# Altium schematic sheet Schematic_Small_Unit_Altium.schdoc
size 280 x 164 mm
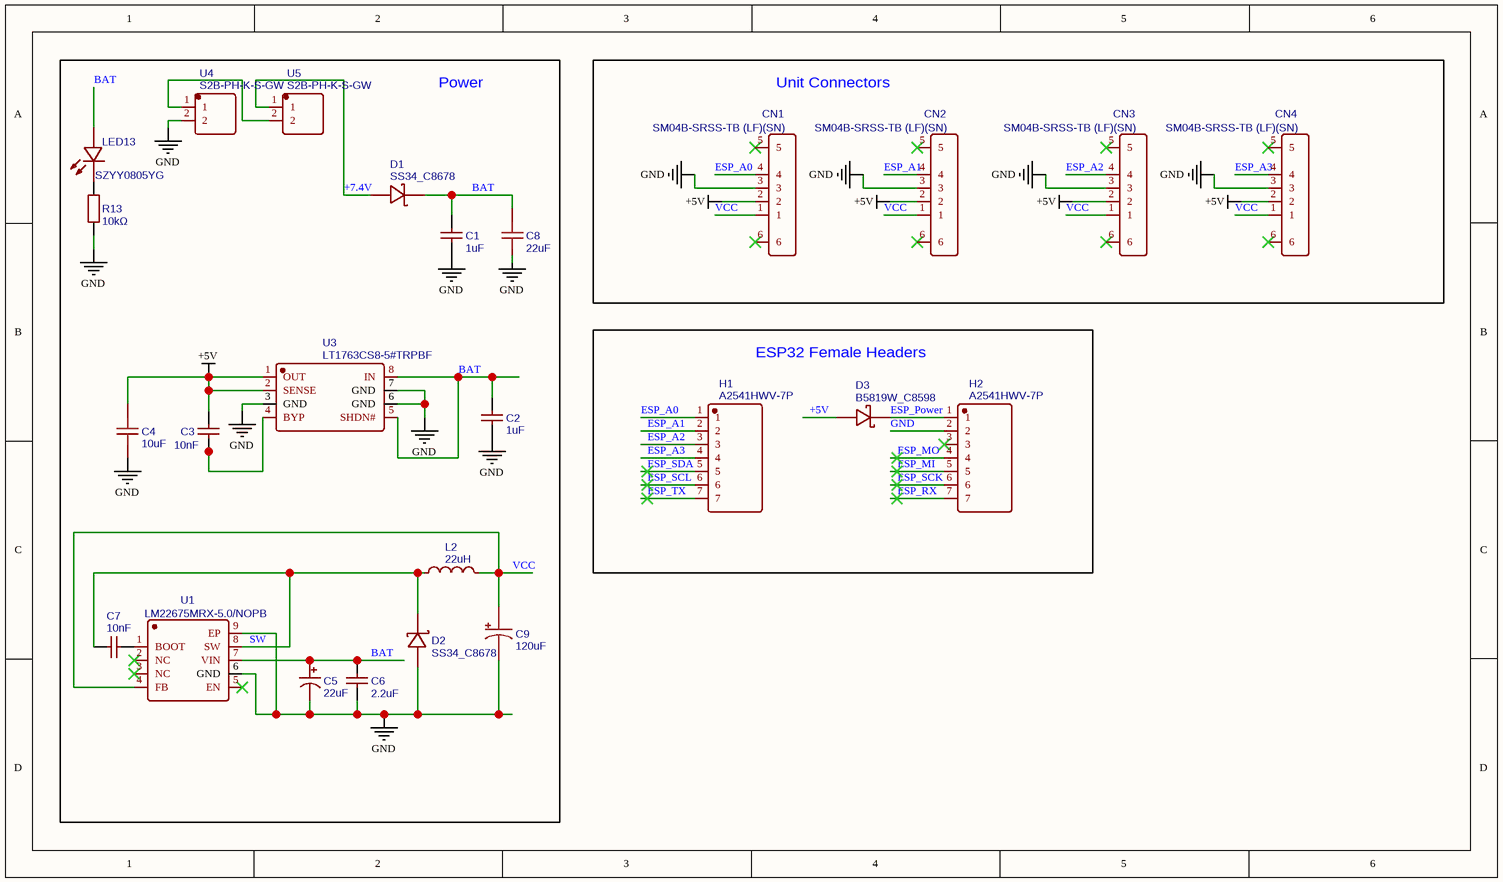
[diagram p0: Schematic_Small_Unit_Altium.schdoc]

## Parts
C1  1uF  [C0805]
C2  1uF  [C0805]
C3  10nF  [C0402]
C4  10uF  [C0603]
C5  22uF  [CAP-SMD_BD5.0-L5.3-W5.3-FD]
C6  2.2uF  [C0603]
C7  10nF  [C0402]
C8  22uF  [C0805]
C9  120uF  [CAP-SMD_BD6.3-L6.6-W6.6-FD]
CN1  SM04B-SRSS-TB (LF)(SN)  [CONN-SMD_4P-P1.00_SM04B-SRSS-TB-LF-SN]
CN2  SM04B-SRSS-TB (LF)(SN)  [CONN-SMD_4P-P1.00_SM04B-SRSS-TB-LF-SN]
CN3  SM04B-SRSS-TB (LF)(SN)  [CONN-SMD_4P-P1.00_SM04B-SRSS-TB-LF-SN]
CN4  SM04B-SRSS-TB (LF)(SN)  [CONN-SMD_4P-P1.00_SM04B-SRSS-TB-LF-SN]
D1  SS34_C8678  [SMA_L4.3-W2.6-LS5.2-RD]
D2  SS34_C8678  [SMA_L4.3-W2.6-LS5.2-RD]
D3  B5819W_C8598  [SOD-123_L2.7-W1.6-LS3.7-RD-1]
H1  A2541HWV-7P  [HDR-TH_7P-P2.54-V_A2541HWV-7P]
H2  A2541HWV-7P  [HDR-TH_7P-P2.54-V_A2541HWV-7P]
L2  22uH  [IND-SMD_L6.0-W6.0_SWPA6045S]
LED13  SZYY0805YG  [LED0805-R-RD_GREEN]
R13  10kΩ  [R0805]
U1  LM22675MRX-5.0/NOPB  [SO-8_L4.9-W3.9-P1.27-LS6.0-BL-EP5.1]
U3  LT1763CS8-5#TRPBF  [SO-8_L4.9-W3.9-P1.27-LS5.9-BL]
U4  S2B-PH-K-S-GW  [CONN-TH_S2B-PH-K-S-GW]
U5  S2B-PH-K-S-GW  [CONN-TH_S2B-PH-K-S-GW]

## Blocks framed on the sheet
Power: C1-C9 D1 D2 L2 LED13 R13 U1 U3-U5
Unit Connectors: CN1-CN4
ESP32 Female Headers: D3 H1 H2

## Nets
+5V: C3.2 C4.2 CN1.2 CN2.2 CN3.2 CN4.2 D3.2(+) U3.1(OUT) U3.2(SENSE)
GND: C1.1 C2.1 C4.1 C5.2 C6.2 C8.1 C9.2 CN1.3 CN2.3 CN3.3 CN4.3 D2.2(A) H2.2 R13.1 U1.6(GND) U1.9(EP) U3.3(GND) U3.6(GND) U3.7(GND) U4.2
+7.4V: D1.2(A) U5.1
BAT: C1.2 C2.2 C5.1 C6.1 C8.2 D1.1(K) LED13.1(+) U1.7(VIN) U3.5(SHDN#) U3.8(IN)
ESP_A0: CN1.4 H1.1
ESP_A1: CN2.4 H1.2
ESP_A2: CN3.4 H1.3
ESP_A3: CN4.4 H1.4
ESP_MI: H2.5
ESP_MO: H2.4
ESP_Power: D3.1(-) H2.1
ESP_RX: H2.7
ESP_SCK: H2.6
ESP_SCL: H1.6
ESP_SDA: H1.5
ESP_TX: H1.7
SW: C7.1 D2.1(K) L2.1 U1.8(SW)
VCC: C9.1 CN1.1 CN2.1 CN3.1 CN4.1 L2.2 U1.4(FB)
NetC3_1: C3.1 U3.4(BYP)
NetC7_2: C7.2 U1.1(BOOT)
NetLED13_2: LED13.2(-) R13.2
NetU4_1: U4.1 U5.2

Not connected (* = marked no-connect by the designer): CN1 5* 6*; CN2 5* 6*; CN3 5* 6*; CN4 5* 6*; H2 3*; U1 2(NC)* 3(NC)* 5(EN)*

## Library data of the parts
C1 C2 = 1uF: Manufacturer Part: CL21B105KBFNNNE; Manufacturer: SAMSUNG(三星); nameAlias: Capacitance; Supplier: LCSC; Supplier Part: C28323; JLCPCB Part Class: Basic Part; spicePre: C; spiceSymbolName: CL21B105KBFNNNE
C3 C7 = 10nF: Manufacturer Part: CL05B103KB5NNNC; Manufacturer: SAMSUNG(三星); nameAlias: Value; Supplier: LCSC; Supplier Part: C15195; JLCPCB Part Class: Basic Part; spicePre: C; spiceSymbolName: CL05B103KB5NNNC
C4 = 10uF: Manufacturer: SAMSUNG(三星); Manufacturer Part: CL10A106KP8NNNC; nameAlias: Value; Supplier: LCSC; Supplier Part: C19702; JLCPCB Part Class: Basic Part; spicePre: C; spiceSymbolName: CL10A106KP8NNNC
C5 = 22uF: Manufacturer: HONOR(荣誉); Manufacturer Part: RVT1E220M0505; nameAlias: Value; Supplier: LCSC; Supplier Part: C15848; JLCPCB Part Class: Extended Part; spicePre: C; spiceSymbolName: RVT1E220M0505-C15848
C6 = 2.2uF: Manufacturer Part: CL10A225KO8NNNC; Manufacturer: SAMSUNG(三星); nameAlias: Value; Supplier: LCSC; Supplier Part: C23630; JLCPCB Part Class: Basic Part; spicePre: C; spiceSymbolName: CL10A225KO8NNNC
C8 = 22uF: Manufacturer: SAMSUNG(三星); Manufacturer Part: CL21A226MAYNNNE; nameAlias: Capacitance; Contributor: LCSC; Supplier: LCSC; Supplier Part: C602037; JLCPCB Part Class: Extended Part; spicePre: C; spiceSymbolName: CL21A226MAYNNNE
C9 = 120uF: Manufacturer: PANASONIC(松下); Manufacturer Part: 10SVPC120MV; nameAlias: Value; Contributor: LCSC; Supplier: LCSC; Supplier Part: C178336; JLCPCB Part Class: Extended Part; spicePre: C; spiceSymbolName: 10SVPC120MV
CN1-CN4 = SM04B-SRSS-TB (LF)(SN): Manufacturer: JST; Contributor: LCSC; Supplier: LCSC; Supplier Part: C160404; Manufacturer Part: SM04B-SRSS-TB(LF)(SN); JLCPCB Part Class: Extended Part; spicePre: C; spiceSymbolName: SM04B-SRSS-TB (LF)(SN)
D1 D2 = SS34_C8678: Manufacturer Part: SS34; Manufacturer: MDD(辰达半导体); Supplier: LCSC; Supplier Part: C8678; JLCPCB Part Class: Basic Part; spicePre: D; spiceSymbolName: SS34_C8678
D3 = B5819W_C8598: Manufacturer: CJ(江苏长电/长晶); Manufacturer Part: B5819W SL; Supplier: LCSC; Supplier Part: C8598; JLCPCB Part Class: Basic Part; spicePre: D; spiceSymbolName: B5819W_C8598
H1 H2 = A2541HWV-7P: Manufacturer: CJT(长江连接器); Contributor: LCSC; Supplier: LCSC; Supplier Part: C225504; Manufacturer Part: A2541HWV-7P; JLCPCB Part Class: Extended Part; spicePre: H; spiceSymbolName: A2541HWV-7P
L2 = 22uH: Manufacturer: Sunlord(顺络); Manufacturer Part: SWPA6045S220MT; nameAlias: Value; Supplier: LCSC; Supplier Part: C83454; JLCPCB Part Class: Extended Part; spicePre: L; spiceSymbolName: SWPA6045S220MT
LED13 = SZYY0805YG: Manufacturer: yongyu(永裕光电); Contributor: LCSC; Supplier: LCSC; Supplier Part: C434435; Manufacturer Part: SZYY0805YG; JLCPCB Part Class: Extended Part; spicePre: L; spiceSymbolName: SZYY0805YG
R13 = 10kΩ: Manufacturer: UNI-ROYAL(厚声); Manufacturer Part: 0805W8F1002T5E; nameAlias: Resistance; Resistance (Ohms): 10K; Supplier: LCSC; Supplier Part: C17414; JLCPCB Part Class: Basic Part; spicePre: R; spiceSymbolName: 0805W8F1002T5E
U1 = LM22675MRX-5.0/NOPB: Manufacturer: TI(德州仪器); Contributor: LCSC; Supplier: LCSC; Supplier Part: C431550; Manufacturer Part: LM22675MRX-5.0/NOPB; JLCPCB Part Class: Extended Part; spicePre: U; spiceSymbolName: LM22675MRX-5.0/NOPB
U3 = LT1763CS8-5#TRPBF: Manufacturer: ADI(亚德诺); Contributor: LCSC; Supplier: LCSC; Supplier Part: C579850; Manufacturer Part: LT1763CS8-5#TRPBF; JLCPCB Part Class: Extended Part; spicePre: U; spiceSymbolName: LT1763CS8-5#TRPBF
U4 U5 = S2B-PH-K-S-GW: Manufacturer: JST; Contributor: LCSC; Supplier: LCSC; Supplier Part: C157932; Manufacturer Part: S2B-PH-K-S-GW; JLCPCB Part Class: Extended Part; spicePre: U; spiceSymbolName: S2B-PH-K-S-GW